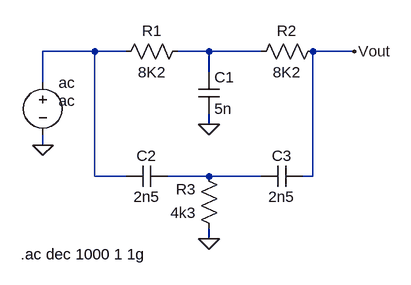
[diagram p0: schematic Twin T Notch.asc]
Twin T Notch.asc, the LTspice schematic file:
Version 4
SHEET 1 880 680
WIRE 0 80 -80 80
WIRE 48 80 0 80
WIRE 176 80 128 80
WIRE 256 80 176 80
WIRE 400 80 336 80
WIRE 176 112 176 80
WIRE -80 128 -80 80
WIRE 176 192 176 176
WIRE -80 224 -80 208
WIRE 0 272 0 80
WIRE 48 272 0 272
WIRE 176 272 112 272
WIRE 256 272 176 272
WIRE 336 272 336 80
WIRE 336 272 320 272
WIRE 176 368 176 352
FLAG 176 192 0
FLAG 176 368 0
FLAG 400 80 Vout
FLAG -80 224 0
SYMBOL res 144 64 R90
WINDOW 0 0 56 VBottom 2
WINDOW 3 32 56 VTop 2
SYMATTR InstName R1
SYMATTR Value 8K2
SYMBOL res 352 64 R90
WINDOW 0 0 56 VBottom 2
WINDOW 3 32 56 VTop 2
SYMATTR InstName R2
SYMATTR Value 8K2
SYMBOL res 192 368 R180
WINDOW 0 36 76 Left 2
WINDOW 3 36 40 Left 2
SYMATTR InstName R3
SYMATTR Value 4k3
SYMBOL cap 160 112 R0
SYMATTR InstName C1
SYMATTR Value 5n
SYMBOL cap 112 256 R90
WINDOW 0 0 32 VBottom 2
WINDOW 3 32 32 VTop 2
SYMATTR InstName C2
SYMATTR Value 2n5
SYMBOL cap 320 256 R90
WINDOW 0 0 32 VBottom 2
WINDOW 3 32 32 VTop 2
SYMATTR InstName C3
SYMATTR Value 2n5
SYMBOL voltage -80 112 R0
WINDOW 3 24 44 Left 2
WINDOW 123 0 0 Left 0
WINDOW 39 0 0 Left 0
SYMATTR InstName ac
SYMATTR Value ac
TEXT -114 392 Left 2 !.ac dec 1000 1 1g

The netlist it stands for:
* Twin T Notch.asc
R1 N002 N001 8K2
R2 Vout N002 8K2
R3 0 N003 4k3
C1 N002 0 5n
C2 N003 N001 2n5
C3 Vout N003 2n5
V§ac N001 0 ac
.ac dec 1000 1 1g
.backanno
.end